# EAGLE schematic extruder board -- placement 2 (EAGLE 6.2)
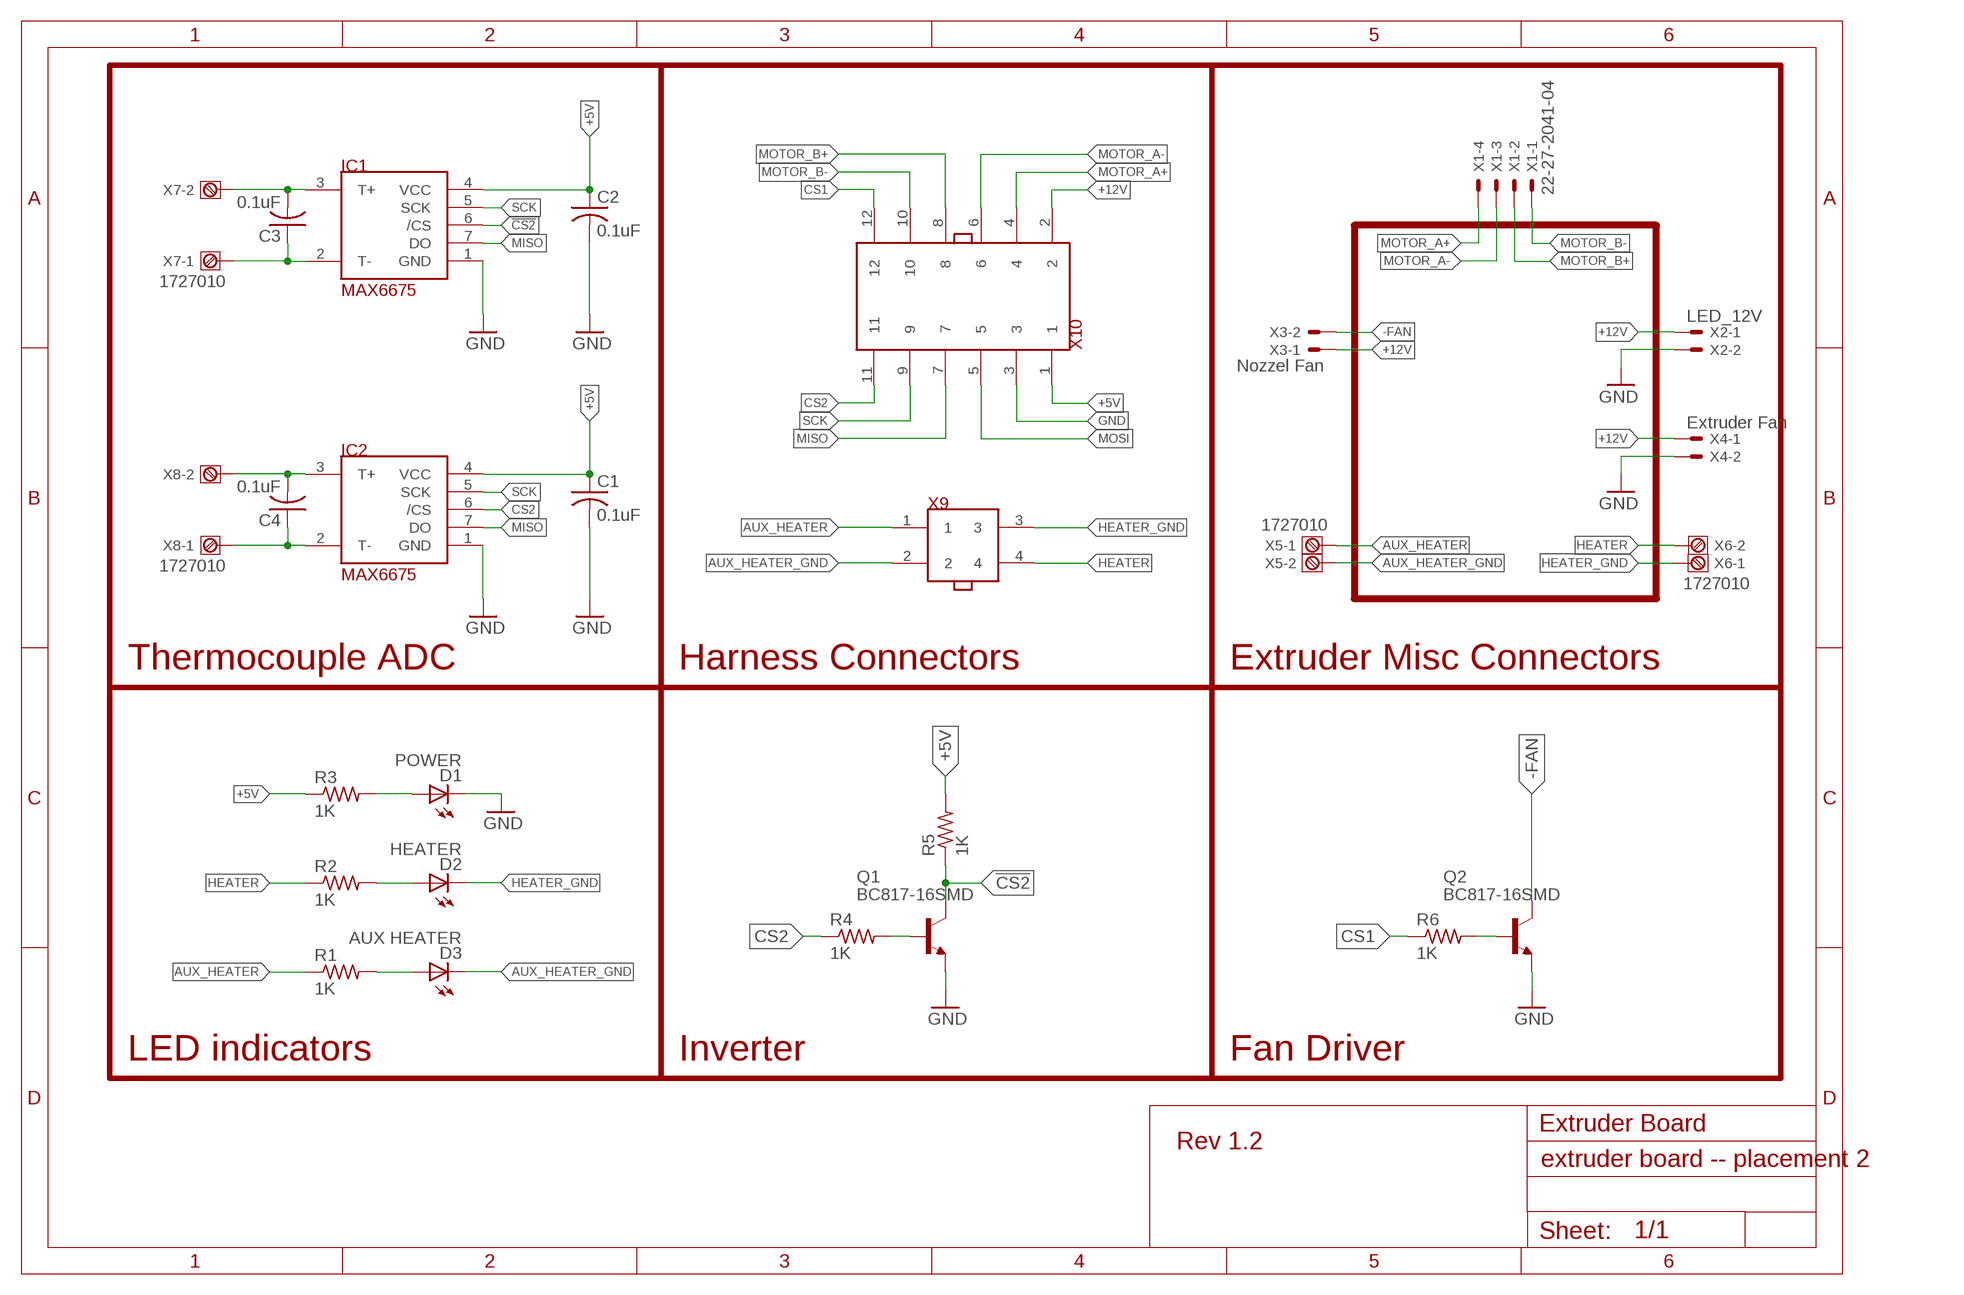
[diagram p0: schematic, sheet 1]

## Parts
C1  0.1uF  C-USC0603K  [C0603K]
C2  0.1uF  C-USC0603K  [C0603K]
C3  0.1uF  C-USC0603K  [C0603K]
C4  0.1uF  C-USC0603K  [C0603K]
D1  POWER  LEDCHIPLED_0805  [CHIPLED_0805]
D2  HEATER  LEDCHIPLED_0805  [CHIPLED_0805]
D3  AUX HEATER  LEDCHIPLED_0805  [CHIPLED_0805]
IC1  MAX6675  [SO-8]
IC2  MAX6675  [SO-8]
Q1  BC817-16SMD  [SOT23-BEC]
Q2  BC817-16SMD  [SOT23-BEC]
R1  1K  R-US_R0603  [R0603]
R2  1K  R-US_R0603  [R0603]
R3  1K  R-US_R0603  [R0603]
R4  1K  R-US_R0603  [R0603]
R5  1K  R-US_R0603  [R0603]
R6  1K  R-US_R0603  [R0603]
X1  22-27-2041-04  [6410-04]
X2  LED_12V  22-27-2021-02  [6410-02]
X3  Nozzel Fan  22-27-2021-02  [6410-02]
X4  Extruder Fan  22-27-2021-02  [6410-02]
X5  1727010  [1727010]
X6  1727010  [1727010]
X7  1727010  [1727010]
X8  1727010  [1727010]
X9  5557-04  [5557-04]
X10  5557-12  [5557-12]

## Nets
!CS2: IC1.6(/CS) Q1.C R5.1
+5V: C1.1 C2.1 IC1.4(VCC) IC2.4(VCC) R3.1 R5.2 X10.1
+12V: X2.1 X3.1 X4.1 X10.2
-FAN: Q2.C X3.2
AUX_HEATER: R1.1 X5.1 X9.1
AUX_HEATER_GND: D3.C X5.2 X9.2
CS1: R6.1 X10.12
CS2: IC2.6(/CS) R4.1 X10.11
GND: C1.2 C2.2 D1.C IC1.1(GND) IC2.1(GND) Q1.E Q2.E X2.2 X4.2 X10.3
HEATER: R2.1 X6.2 X9.4
HEATER_GND: D2.C X6.1 X9.3
MISO: IC1.7(DO) IC2.7(DO) X10.7
MOSI: X10.5
MOTOR_A+: X1.4 X10.4
MOTOR_A-: X1.3 X10.6
MOTOR_B+: X1.2 X10.8
MOTOR_B-: X1.1 X10.10
N$1: C4.1 IC2.2(T-) X8.1
N$2: C3.1 IC1.2(T-) X7.1
N$3: C3.2 IC1.3(T+) X7.2
N$4: C4.2 IC2.3(T+) X8.2
N$5: D1.A R3.2
N$6: Q1.B R4.2
N$7: D2.A R2.2
N$8: D3.A R1.2
N$9: Q2.B R6.2
SCK: IC1.5(SCK) IC2.5(SCK) X10.9

## Notes on the sheet
- Thermocouple ADC | Harness Connectors | Extruder Misc Connectors
- LED indicators | Inverter | Fan Driver
- Extruder Board
- Rev 1.2

## Library data of the parts
C1-C4 = extruder_board_--_placement_2:C-US: CAPACITOR, American symbol
D1-D3 = extruder_board_--_placement_2:LED: LED OSRAM: - CHIPLED LG R971, LG N971, LY N971, LG Q971, LY Q971, LO R971, LY R971 LH N974, LH R974 LS Q976, LO Q976, LY Q976 LO Q996 - Hyper CHIPLED LW Q18S LB Q993, LB Q99A, LB R99A - SideLED LS A670, LO A670, LY A670, LG A670, LP A670 LB A673, LV A673, LT A673, LW A673 LH A674 LY A675 LS A676, LA A676, LO A676, LY A676, LW A676 LS A679, LY A679, LG A679 - Hyper Micro SIDELED® LS Y876, LA Y876, LO Y876, LY Y876 LT Y87S - SmartLED LW L88C, LW L88S LB L89C, LB L89S, LG L890 LS L89K, LO L89K, LY L89K LS L896, LA L896, LO L896, LY L896 - TOPLED LS T670, LO T670, LY T670, LG T670, LP T670 LSG T670, LSP T670, LSY T670, LOP T670, LYG T670 LG T671, LOG T671, LSG T671 LB T673, LV T673, LT T673, LW T673 LH T674 LS T676, LA T676, LO T676, LY T676, LB T676, LH T676, LSB T676, LW T676 LB T67C, LV T67C, LT T67C, LS T67K, LO T67K, LY T67K, LW E67C LS E67B, LA E67B, LO E67B, LY E67B, LB E67C, LV E67C, LT E67C LW T67C LS T679, LY T679, LG T679 LS T770, LO T770, LY T770, LG T770, LP T770 LB T773, LV T773, LT T773, LW T773 LH T774 LS E675, LA E675, LY E675, LS T675 LS T776, LA T776, LO T776, LY T776, LB T776 LHGB T686 LT T68C, LB T68C - Hyper Mini TOPLED® LB M676 - Mini TOPLED Santana® LG M470 LS M47K, LO M47K, LY M47K Source: http://www.osram.convergy.de LUXEON: - LUMILED® LXK2-PW12-R00, LXK2-PW12-S00, LXK2-PW14-U00, LXK2-PW14-V00 LXK2-PM12-R00, LXK2-PM12-S00, LXK2-PM14-U00 LXK2-PE12-Q00, LXK2-PE12-R00, LXK2-PE12-S00, LXK2-PE14-T00, LXK2-PE14-U00 LXK2-PB12-K00, LXK2-PB12-L00, LXK2-PB12-M00, LXK2-PB14-N00, LXK2-PB14-P00, LXK2-PB14-Q00 LXK2-PR12-L00, LXK2-PR12-M00, LXK2-PR14-Q00, LXK2-PR14-R00 LXK2-PD12-Q00, LXK2-PD12-R00, LXK2-PD12-S00 LXK2-PH12-R00, LXK2-PH12-S00 LXK2-PL12-P00, LXK2-PL12-Q00, LXK2-PL12-R00 Source: www.luxeon.com KINGBRIGHT: KA-3528ASYC Source: www.kingbright.com
IC1 IC2 = extruder_board_--_placement_2:MAX6675
Q1 Q2 = extruder_board_--_placement_2:BC817*: NPN Transistor
R1-R6 = extruder_board_--_placement_2:R-US_: RESISTOR, American symbol
X1 = extruder_board_--_placement_2:22-?-04: CONNECTOR wire to board 2.54 mm (.1 inch) pitch header; OC_FARNELL: unknown; OC_NEWARK: unknown
X2-X4 = extruder_board_--_placement_2:22-?-02: CONNECTOR wire to board 2.54 mm (.1 inch) pitch header; OC_FARNELL: unknown; OC_NEWARK: unknown
X5-X8 = extruder_board_--_placement_2:1727010
X9 = extruder_board_--_placement_2:5557-04
X10 = extruder_board_--_placement_2:5557-12

## Net classes
1 power: width 1.27 mm